# Altium schematic sheet PWU soldeerbout.SchDoc
size A4; SheetNumber: 2; SheetTotal: 5
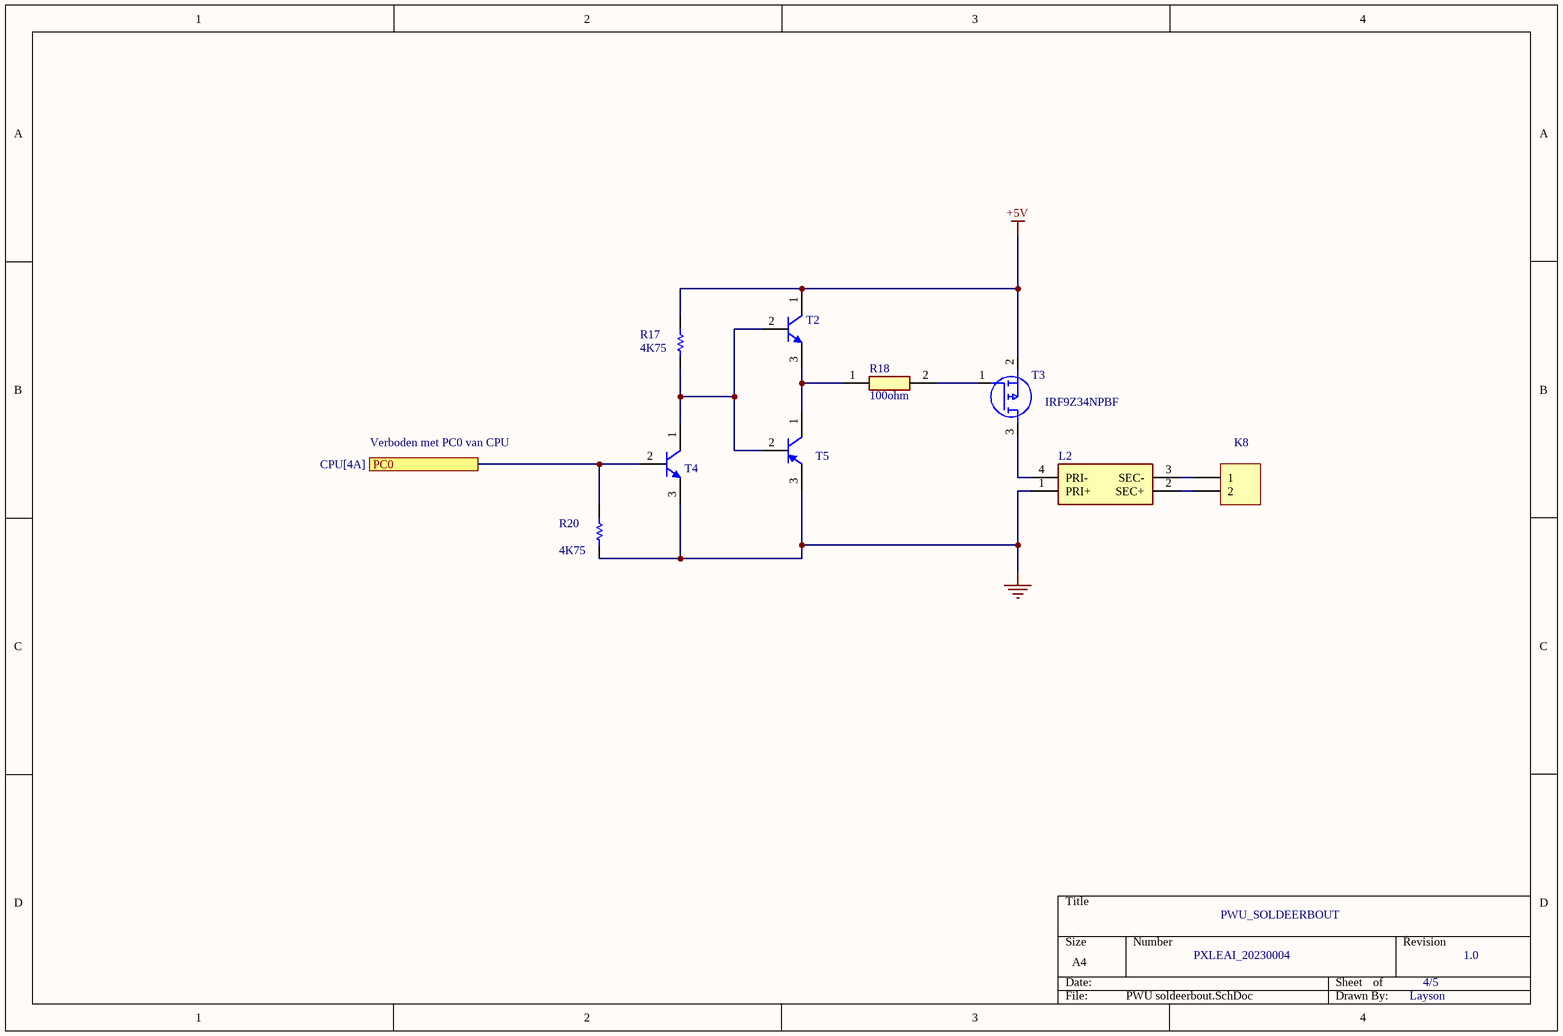
[diagram p0: PWU soldeerbout.SchDoc]

## Parts
K8  Header 2  [HDR1X2]  (value not drawn)
L2  CM2545X171B-10  [CM2545X171B10]  (value not drawn)
R17  4K75  [RESA60-630X240]
R18  100ohm  [RESC2012X60N]
R20  4K75  [RESA60-630X240]
T2  BC547B  [ONSC-TO-92-3-29-11]  (value not drawn)
T3  IRF9Z34NPBF  [TO254P469X1042X1967-3P]
T4  T4  [ONSC-TO-92-3-29-11]
T5  T5  [ONSC-TO-92-3-29-11_AM_BL]

## Ports
PC0 (see CPU[4A])

## Nets
+5V: R17.1 T2.1(C) T3.2(S)
GND: L2.1(PRI+) R20.1 T4.3(E) T5.3(E)
PC0: R20.2 T4.2(B) ; port PC0
NetK8_1: K8.1 L2.3(SEC-)
NetK8_2: K8.2 L2.2(SEC+)
NetL2_4: L2.4(PRI-) T3.3(D)
NetR17_2: R17.2 T2.2(B) T4.1(C) T5.2(B)
NetR18_1: R18.1 T2.3(E) T5.1(C)
NetR18_2: R18.2 T3.1(G)

## Notes on the sheet
- Verboden met PC0 van CPU
- PWU_SOLDEERBOUT
- PXLEAI_20230004
- 4/5
- 1.0
- Layson

## Library data of the parts
K8 = Header 2: Header, 2-Pin; LatestRevisionDate: 17-Jul-2002; LatestRevisionNote: Re-released for DXP Platform.; Publisher: Altium Limited
L2 = CM2545X171B-10: Transformer; Manufacturer_Name: Laird Technologies; Datasheet Link: https://datasheet.datasheetarchive.com/originals/dk/DKDS-7/122753.pdf; Height: 9.5mm; Manufacturer_Part_Number: CM2545X171B-10; Mouser Part Number: N/A; Mouser Price/Stock: https://www.mouser.co.uk/ProductDetail/Laird/CM2545X171B-10?qs=PzGy0jfpSMtNfkEypgU65A%3D%3D; Arrow Part Number: CM2545X171B-10; Arrow Price/Stock: https://www.arrow.com/en/products/cm2545x171b-10/laird-technologies
R17 R20 = CMP-1659-00066-1: Axial Resistor, 4.75 KOhm, +/- 1%, 0.25 W, -55 to 155 degC, 2-Pin THD, RoHS, Bulk; Case\Package: 1210; Voltage Rating (DC): 25 V; Type (Capacitors): X7R; Capacitance: 22 uF; Tolerance: 10%; PackageReference: MFR-25; DatasheetVersion: Apr-13; PackageDescription: 2-Pin Axial Lead, Dia 2.4 mm, Body Length 6.3 mm; ComponentLink1URL: http://www.yageo.com/; Radiation Hardening: No; Mount: Surface Mount; Height: 2.5 mm; Pins: 2; Package Quantity: 1000; REACH SVHC: No SVHC; Case Code (Imperial): 1210; Packaging: Tape and Reel; Max Operating Temperature: 125 degC; Case Code (Metric): 3225; ComponentLink1Description: Manufacturer URL; Min Operating Temperature: -55 degC; ComponentLink2Description: Datasheet; Voltage Rating: 25 V; Length: 3.2 mm; ComponentLink2URL: http://www.yageo.com/documents/recent/Yageo%20LR_MFR_2013.pdf; RoHSCompliant: true; Width: 2.5 mm
R18 = CR0805-JW-101ELF: Resistor / CR0805-JW-101ELF; Manufacturer_Name: Bourns; Datasheet Link: https://www.bourns.com/pdfs/chpreztr.pdf; Height: 0.6mm; Manufacturer_Part_Number: CR0805-JW-101ELF; Mouser Part Number: 652-CR0805JW-101ELF; Mouser Price/Stock: https://www.mouser.co.uk/ProductDetail/Bourns/CR0805-JW-101ELF?qs=wL7NMIHXUPl5EcPQbx1sug%3D%3D; Arrow Part Number: CR0805-JW-101ELF; Arrow Price/Stock: https://www.arrow.com/en/products/cr0805-jw-101elf/bourns?region=nac
T2 = CMP-1048-01467-1: Amplifier Transistor, NPN Silicon, 3-Pin TO-92, Bulk Box; Manufacturer: On Semiconductor; IC Continuous (A): 0.1; fT Min (MHz): 150; DatasheetVersion: Rev. 7; ComponentLink1URL: http://www.onsemi.com/; Polarity: NPN; RoHS: FALSE; ComponentLink1Description: Manufacturer URL; Packing: Bulk Box; PackageDescription: 3-Pin Transistor Outline, Body 4.825 x 3.685 mm, Pitch 1.27 mm; ComponentLink3URL: http://www.onsemi.cn/pub_link/Collateral/2N6426-D.PDF; ComponentLink2Description: Datasheet; PackageVersion: Rev. AM; PackageReference: TO-92-3-29-11_AM_SL; ComponentLink3Description: Package Specification; Mounting Technology: Through Hole; PartNumber: BC547B; ComponentLink2URL: http://www.onsemi.com/pub_link/Collateral/BC546-D.PDF
T3 = IRF9Z34NPBF: MOSFET MOSFT PCh -55V -17A 100mOhm 23.3nC; Manufacturer_Name: Infineon; Geometry.Height: 4.69mm; Manufacturer_Part_Number: IRF9Z34NPBF; Mouser Part Number: 942-IRF9Z34NPBF; Mouser Price/Stock: https://www.mouser.co.uk/ProductDetail/Infineon-Technologies/IRF9Z34NPBF?qs=9%252BKlkBgLFf16a%2FvlD%252BMCtQ%3D%3D; Arrow Part Number: IRF9Z34NPBF; Arrow Price/Stock: https://www.arrow.com/en/products/irf9z34npbf/infineon-technologies-ag?region=nac; Datasheet Link: https://www.infineon.com/dgdl/irf9z34npbf.pdf?fileId=5546d462533600a40153561220af1ddd
T4 = CMP-1048-01467-1: Amplifier Transistor, NPN Silicon, 3-Pin TO-92, Bulk Box; Manufacturer: On Semiconductor; PartNumber: BC547B; IC Continuous (A): 0.1; fT Min (MHz): 150; DatasheetVersion: Rev. 7; ComponentLink1URL: http://www.onsemi.com/; Polarity: NPN; RoHS: FALSE; ComponentLink1Description: Manufacturer URL; Packing: Bulk Box; PackageDescription: 3-Pin Transistor Outline, Body 4.825 x 3.685 mm, Pitch 1.27 mm; ComponentLink3URL: http://www.onsemi.cn/pub_link/Collateral/2N6426-D.PDF; ComponentLink2Description: Datasheet; PackageVersion: Rev. AM; PackageReference: TO-92-3-29-11_AM_SL; ComponentLink3Description: Package Specification; Mounting Technology: Through Hole; ComponentLink2URL: http://www.onsemi.com/pub_link/Collateral/BC546-D.PDF
T5 = CMP-1048-01514-1: Amplifier Transistor, PNP Silicon, 3-Pin TO-92, Pb-Free, Ammo Box; PartNumber: BC557AZL1G; Manufacturer: On Semiconductor; IC Continuous (A): -0.1; ComponentLink1Description: Manufacturer URL; ComponentLink2URL: http://www.onsemi.com/pub_link/Collateral/BC556B-D.PDF; PackageVersion: Rev. AM; Mounting Technology: Through Hole; Polarity: PNP; RoHS: TRUE; ComponentLink3URL: http://www.onsemi.com/pub_link/Collateral/MAC97-D.PDF; ComponentLink3Description: Package Specification; ComponentLink1URL: http://www.onsemi.com/; PackageDescription: 3-Pin Transistor Outline, Body 4.825 x 3.685 mm, Pitch 1.27 mm; Packing: Ammo Box; PackageReference: TO-92-3-29-11_AM_BL; ComponentLink2Description: Datasheet; DatasheetVersion: Rev. 3